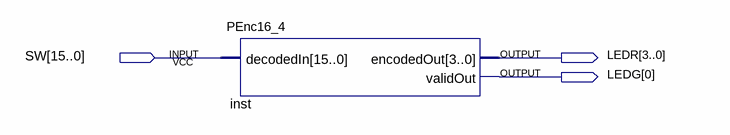
[diagram p0: schematic sheet]
// Quartus schematic PEnc16_4Demo.bdf as structural Verilog: 1 symbols, 3 pins
module PEnc16_4Demo (
  input  [15:0] SW,
  output [3:0] LEDR,
  output [0:0] LEDG
);

  PEnc16_4 inst (.decodedIn(SW), .encodedOut(LEDR), .validOut(LEDG[0]));
endmodule
